# Altium schematic sheet 04_Mechanical.SchDoc: Mechanicals
size A; Revision: A; SheetNumber: 4; SheetTotal: 4; ECE315_Project_Name: ECE453 Base Project
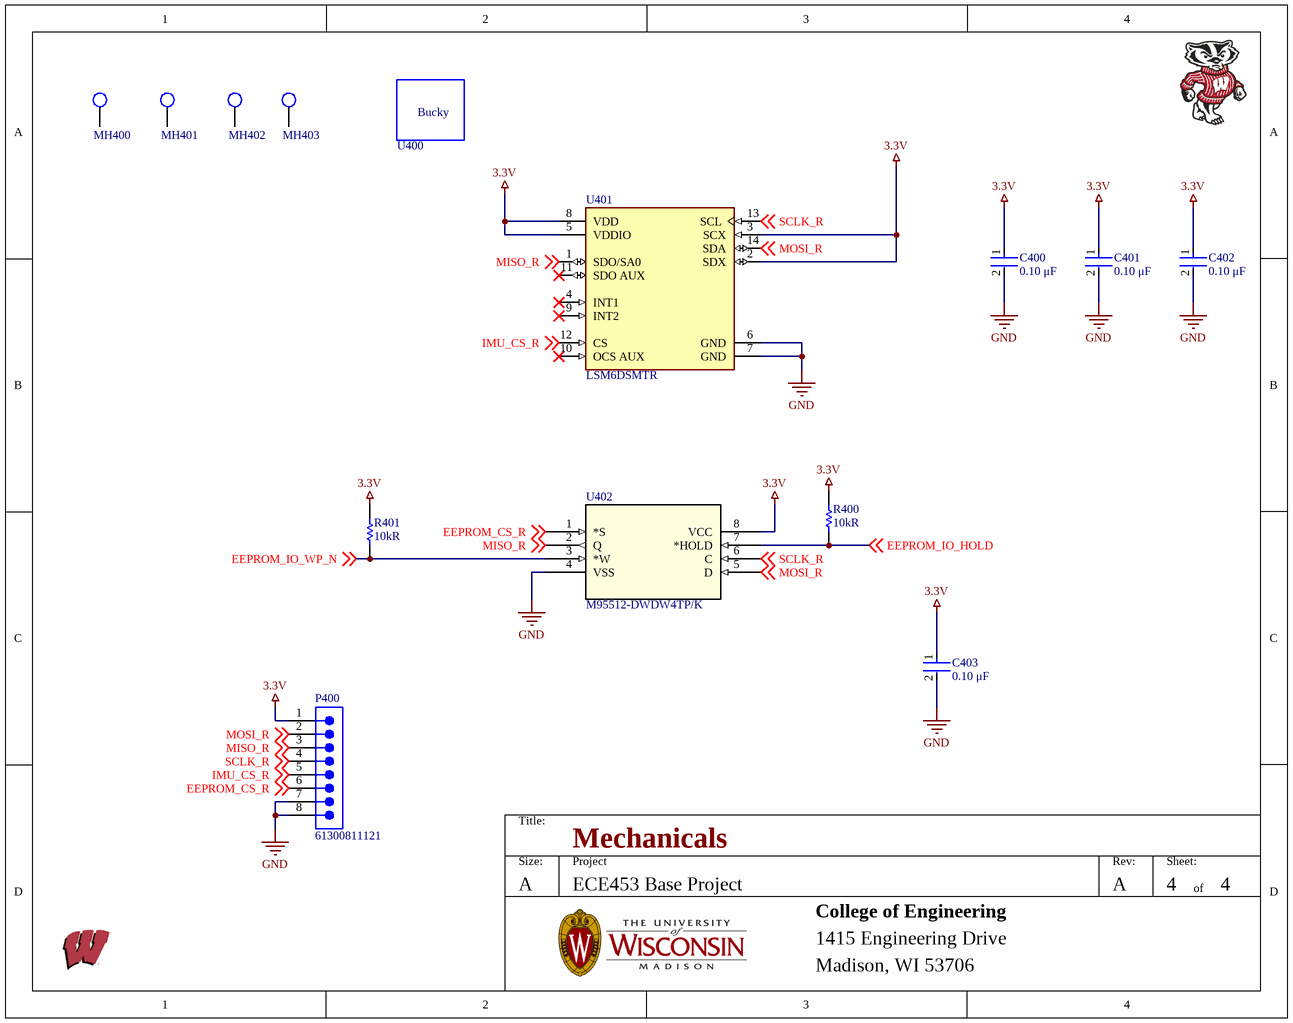
[diagram p0: 04_Mechanical.SchDoc]

## Parts
C400  0.10 μF  [FP-C0805C-DN-MFG]
C401  0.10 μF  [FP-C0805C-DN-MFG]
C402  0.10 μF  [FP-C0805C-DN-MFG]
C403  0.10 μF  [FP-C0805C-DN-MFG]
MH400  MHOLE_2_55MM  [MHOLE_2_55MM]  (value not drawn)
MH401  MHOLE_2_55MM  [MHOLE_2_55MM]  (value not drawn)
MH402  MHOLE_2_55MM  [MHOLE_2_55MM]  (value not drawn)
MH403  MHOLE_2_55MM  [MHOLE_2_55MM]  (value not drawn)
P400  61300811121  [61300811121]
R400  10kR  [RESC2013X70X40ML20T20]
R401  10kR  [RESC2013X70X40ML20T20]
U400  Bucky  [WalkingBucky]  (value not drawn)  (no BOM)
U401  LSM6DSMTR  [FP-LGA-14L-DM00249496-MFG]
U402  M95512-DWDW4TP/K  [TSSOP8_169MILS_DW_STM-M]

## Nets
3.3V: C400.1 C401.1 C402.1 C403.1 P400.1 R400.2 R401.2 U401.2(SDX) U401.3(SCX) U401.5(VDDIO) U401.8(VDD) U402.8(VCC)
GND: C400.2 C401.2 C402.2 C403.2 P400.7 P400.8 U401.6(GND) U401.7(GND) U402.4(VSS)
EEPROM_CS_R: P400.6 U402.1(*S) ; off-sheet EEPROM_CS_R
EEPROM_IO_HOLD: R400.1 U402.7(*HOLD) ; off-sheet EEPROM_IO_HOLD
EEPROM_IO_WP_N: R401.1 U402.3(*W) ; off-sheet EEPROM_IO_WP_N
IMU_CS_R: P400.5 U401.12(CS) ; off-sheet IMU_CS_R
MISO_R: P400.3 U401.1(SDO/SA0) U402.2(Q) ; off-sheet MISO_R
MOSI_R: P400.2 U401.14(SDA) U402.5(D) ; off-sheet MOSI_R
SCLK_R: P400.4 U401.13(SCL) U402.6(C) ; off-sheet SCLK_R

Not connected (* = marked no-connect by the designer): MH400 1; MH401 1; MH402 1; MH403 1; U401 4(INT1)* 9(INT2)* 10(OCS_AUX)* 11(SDO_AUX)*

## Notes on the sheet
- Title:
- Size:
- A
- Project
- Rev:
- Sheet:
- of
- College of Engineering
- 1415 Engineering Drive
- Madison, WI 53706

## Library data of the parts
C400-C403 = CMP-2007-00279-2: CAP CER 0.1UF 50V X7R 0805; Manufacturer Part Number: C0805C104K5RACTU; Manufacturer: KEMET; Tolerance: 0.1; Temperature Coefficient: 30ppm/°C; Material: Ceramic; Voltage: 500V; Device Class L2: Capacitors; Temperature Range Low: -55°C; Voltage Rating: 50 V; Digikey Description: CAP CER 0.1UF 50V X7R 0805; Value: 0.10 μF; Category: Cap; ComponentLink2Description: Datasheet; Octopart: https://octopart.com/c0805c104k5ractu-kemet-143926; RoHS: TRUE; ComponentLink2URL: https://content.kemet.com/datasheets/KEM_C1003_C0G_SMD.pdf; Temperature Characteristic: X7R; Temperature: -55°C to +125°C; Height: 0.88mm; Temperature Range High: +125°C; Device Class L1: Passive Components; Automotive: No; Lead Free: Yes; Ipc Land Pattern Name: CAPC200125X78; Device Class L3: Ceramic Capacitors; Mouser Description: Cap Ceramic 0.1uF 50V X7R 10% SMD 2.0 x 1.2 mm 125 C Paper T/R; Capacitance: 0.10 μF; Package: C0805C-DN; Supplier: Digikey; Supplier Part Number: 399-C0805C104K5RAC7800CT-ND; Stock: 1813524; Pricing: 1=0.14, 10=0.091, 50=0.0546, 100=0.043, 500=0.03172, 1000=0.02627 (USD); Mounting Technology: Surface Mount,PCB; Case/Package: 0805; Pins: 2; Case Code (Imperial): 0805; Case Code (Metric): 2012; Min Operating Temperature: -55°C; Max Operating Temperature: 125°C; Dielectric: X7R; Package Quantity: 4000; Packaging: Tape and Reel; Voltage Rating (DC): 50V; Termination: SMD/SMT; Series: SMD Comm X7R; Construction: Flat; Length: 2mm; Width: 1.2mm; Depth: 1.25mm; Lead Pitch: 0.75mm; Radiation Hardening: No; RoHS Compliant: Yes; Reach SVHC Compliant: No; ComponentLink1URL: https://datasheet.ciiva.com/32431/slceramic-chip-condensers-e-32431755.pdf?src-supplier=Distrelec; ComponentLink1Description: https://datasheet.ciiva.com/32431/slceramic-chip-condensers-e-32431755.pdf?src-supplier=Distrelec; ComponentLink3URL: https://datasheet.ciiva.com/28682/1851736-28682232.pdf?src-supplier=Element14; ComponentLink3Description: https://datasheet.ciiva.com/28682/1851736-28682232.pdf?src-supplier=Element14; ComponentLink4URL: https://datasheet.ciiva.com/18410/70095383-18410815.pdf?src-supplier=Allied+Electronics; ComponentLink4Description: https://datasheet.ciiva.com/18410/70095383-18410815.pdf?src-supplier=Allied+Electronics; ComponentLink5URL: https://datasheet.ciiva.com/14589/70095383-14589048.pdf?src-supplier=Allied+Electronics; ComponentLink5Description: https://datasheet.ciiva.com/14589/70095383-14589048.pdf?src-supplier=Allied+Electronics
MH400-MH403 = MHOLE_2_55MM: Mounting Holde; Manufacturer Part Number: UW MTHOLE
P400 = CMP-1502-01076-2: NexarPartId: 32855533; Manufacturer: Wurth Electronics; Current Rating: 3A; Connector Type: Male Pin; Voltage Rating: 250V; Number of Contacts: 8; Pitch: 2.54mm; Contact Resistance: 20mΩ; Gender: Male; REACH SVHC: Unknown; Number of Rows: 1; Mount: Through Hole; Termination: Solder; Number of Pins: 8; Number of Positions: 8; Height: 8.54mm; Contact Mating Length: 5.9944mm; Orientation: Vertical; Operating Supply Voltage: 250V; Min Operating Temperature: -40°C; Max Operating Temperature: 105°C; Packaging: Bulk; Color: Black; Lead Pitch: 2.54mm; RoHS: Compliant; Contact Material: Copper; Contact Plating: Gold; Supplier: Digikey; Supplier Part Number: 732-5321-ND; Manufacturer Part Number: 61300811121; Category: Headers and Wire Housings; Stock: 13018; Pricing: 1=0.4, 10=0.336, 25=0.28, 50=0.234, 100=0.212, 1000=0.193 (USD); Mounting Technology: Through Hole; Series: WR-PHD; Contact Type: Male Pin; RoHS Compliant: Yes; Reach SVHC Compliant: Unknown; ComponentLink1URL: https://datasheet.octopart.com/61300811121-W%C3%BCrth-Elektronik-datasheet-21154836.pdf?src-supplier=Element14; ComponentLink1Description: https://datasheet.octopart.com/61300811121-W%C3%BCrth-Elektronik-datasheet-21154836.pdf?src-supplier=Element14; ComponentLink2URL: https://katalog.we-online.de/em/datasheet/6130xx11121.pdf?src-supplier=Digikey; ComponentLink2Description: https://katalog.we-online.de/em/datasheet/6130xx11121.pdf?src-supplier=Digikey
R400 R401 = CMP-2001-04376-1: Manufacturer: Panasonic; Part Number: ERJ-6ENF1002V; Tolerance: 1%; Power: 125mW; Rated Temperature: 70°C; Temperature Coefficient: 100ppm/°C; Working Voltage: 150V; Package Height: 0.6mm; Package Length: 2mm; Package Width: 1.25mm; Reference Standard: AEC-Q200; Supplier: Digikey; Supplier Part Number: P10.0KCCT-ND; Manufacturer Part Number: ERJ-6ENF1002V; RoHS: Yes; Category: Chip SMD Resistors; Stock: 663782; Pricing: 1=0.11, 10=0.053, 50=0.0344, 100=0.0292, 500=0.02058, 1000=0.01792 (USD); Mounting Technology: Surface Mount; Pins: 2; Package Shape: Rectangular; Case/Package: 0805; Terminal Finish: Nickel; Min Operating Temperature: -55°C; Max Operating Temperature: 155°C; JESD-609 Code: e3; Resistor Type: FIXED RESISTOR; Construction: Rectangular; Package Style: SMTMeter; Packaging: Tape and Reel; Value: 10kR; Technology: METAL GLAZE/THICK FILM; Termination: Wraparound; Reach SVHC Compliant: Yes; RoHS Compliant: Yes; ComponentLink1URL: https://datasheet.ciiva.com:443/pdfs/VipMasterIC/IC/PANA/PANA-S-A0009889626/PANA-S-A0009889626-1.pdf?src-supplier=IHS+Markit; ComponentLink1Description: https://datasheet.ciiva.com:443/pdfs/VipMasterIC/IC/PANA/PANA-S-A0009889626/PANA-S-A0009889626-1.pdf?src-supplier=IHS+Markit; ComponentLink2URL: https://datasheet.ciiva.com/11808/0900766b80f80784-11808080.pdf?src-supplier=Rs; ComponentLink2Description: https://datasheet.ciiva.com/11808/0900766b80f80784-11808080.pdf?src-supplier=Rs; ComponentLink3URL: https://datasheet.ciiva.com/7830/426256-7830745.pdf?src-supplier=Element14; ComponentLink3Description: https://datasheet.ciiva.com/7830/426256-7830745.pdf?src-supplier=Element14; ComponentLink4URL: https://datasheet.ciiva.com/27055/1988971-27055733.pdf?src-supplier=Jameco; ComponentLink4Description: https://datasheet.ciiva.com/27055/1988971-27055733.pdf?src-supplier=Jameco; ComponentLink5URL: https://datasheet.ciiva.com/46372/1678782-46372715.pdf?src-supplier=Element14; ComponentLink5Description: https://datasheet.ciiva.com/46372/1678782-46372715.pdf?src-supplier=Element14; ComponentLink6URL: https://datasheet.ciiva.com/46372/1678782-46372714.pdf?src-supplier=Element14; ComponentLink6Description: https://datasheet.ciiva.com/46372/1678782-46372714.pdf?src-supplier=Element14; ComponentLink7URL: https://datasheet.ciiva.com/24070/aoa0000ce2-24070702.pdf?src-supplier=Mouser; ComponentLink7Description: https://datasheet.ciiva.com/24070/aoa0000ce2-24070702.pdf?src-supplier=Mouser; ComponentLink8URL: https://datasheet.ciiva.com/16725/70260748-16725031.pdf?src-supplier=Allied+Electronics; ComponentLink8Description: https://datasheet.ciiva.com/16725/70260748-16725031.pdf?src-supplier=Allied+Electronics; ComponentLink9URL: https://datasheet.ciiva.com/16759/70260748-16759350.pdf?src-supplier=Allied+Electronics; ComponentLink9Description: https://datasheet.ciiva.com/16759/70260748-16759350.pdf?src-supplier=Allied+Electronics; ComponentLink10URL: https://datasheet.ciiva.com/30140/aoa0000ce2-30140236.pdf?src-supplier=Onlinecomponents.com; ComponentLink10Description: https://datasheet.ciiva.com/30140/aoa0000ce2-30140236.pdf?src-supplier=Onlinecomponents.com
U400 = Bucky: Bucky Badger Image; Manufacturer Part Number: UW Bucky
U401 = CMP-12177-000008-1: IMU ACCEL/GYRO I2C/SPI 14LGA; Manufacturer: STMicroelectronics; Operating Supply Current: 0.29-0.65mA; Gyro Range: 125/250/500/1000/2000°/s; Sensor Output: I2C,SPI; Accel Range: 2/4/8/16g; Min Supply Voltage: 1.62V; Resolution: 16bits; Sensor Type: Temperature,Accelerometer,Gyroscope; Max Supply Voltage: 3.6V; Interface: SPI,Serial; Density: 512Kb; Memory Format: EEPROM; Frequency: 16MHz; Access Time-Max: 25ns; Organization: 64KX8; Programming Voltage: 5.5V; Write Protection: YES; Supply Current: 4mA; Manufacturer Part Number: LSM6DSMTR; Octopart: https://octopart.com/lsm6dsmtr-stmicroelectronics-66358194; Height: 0.86mm; Category: IC; Lead Free: Yes; Temperature: -40°C to +85°C; Temperature Range Low: -40°C; ComponentLink2Description: Datasheet; ComponentLink2URL: https://www.st.com/resource/en/datasheet/lsm6dsm.pdf; Digikey Description: IMU ACCEL/GYRO I2C/SPI 14LGA; Footprint Url: https://www.st.com/content/ccc/resource/technical/document/technical_note/73/17/9c/16/dd/96/4a/01/CD00134799.pdf/files/CD00134799.pdf/jcr:content/translations/en.CD00134799.pdf; Device Class L1: Sensors; Device Class L2: Motion Sensors; Temperature Range High: +85°C; Mouser Description: LSM6DSM Series 3.6 V I2C/SPI 3D Accelerometer and 3D Gyroscope - LGA-14; Device Class L3: Inertial Measurement Units (IMUs); Automotive: No; Package: LGA-14L-DM00249496; RoHS: TRUE; Supplier: Digikey; Supplier Part Number: 497-14459-1-ND; Stock: 18746; Pricing: 1=2.2, 10=1.974, 25=1.9432, 50=1.938, 100=1.7317, 250=1.6748, 500=1.6687, 1000=1.55386 (USD); Mounting Technology: Surface Mount; Case/Package: TSSOP; Pins: 8; Min Operating Temperature: -40°C; Max Operating Temperature: 145°C; Packaging: Tape and Reel; Clock Frequency: 16MHz; Series: -; Radiation Hardening: No; RoHS Compliant: Yes; ComponentLink1URL: https://datasheet.ciiva.com/29614/dm00046608-29614432.pdf?src-supplier=Digikey; ComponentLink1Description: https://datasheet.ciiva.com/29614/dm00046608-29614432.pdf?src-supplier=Digikey; ComponentLink3URL: https://datasheet.ciiva.com/48501/dm00046608-48501612.pdf?src-supplier=Avnet; ComponentLink3Description: https://datasheet.ciiva.com/48501/dm00046608-48501612.pdf?src-supplier=Avnet
U402 = M95512-DWDW4TP/K: EEPROM Serial-SPI 512K-bit 64K x 8 3.3V/5V Automotive 8-Pin TSSOP T/R; Mfr_Name: STMicroelectronics; Interface: SPI,Serial; Access Time: 25ns; Density: 512Kb; Frequency: 10MHz; Min Supply Voltage: 2.5V; Max Supply Voltage: 5.5V; Max Frequency: 16MHz; Nominal Supply Current: 4mA; Copyright: Copyright (C) 2022 Ultra Librarian. All rights reserved.; Manufacturer_Part_Number: M95512-DWDW4TP/K; RefDes: RefDes; Type: DEV; Supplier 1: Digi-Key; Supplier Part Number 1: 497-14459-1-ND; Manufacturer 1: STMicroelectronics; Manufacturer Part Number 1: M95512-DWDW4TP/K; RoHS: Yes; Category: EEPROM; Stock 1: 11469; Pricing 1: 1=2.30000, 10=2.07100, 25=2.03920, 50=2.03400, 100=1.81740, 250=1.76084 (USD); Mount: Surface Mount; Case/Package: TSSOP; Number of Pins: 8; Min Operating Temperature: -40°C; Max Operating Temperature: 145°C; Packaging: Tape and Reel; Memory Type: EEPROM; Radiation Hardening: No; RoHS Compliant: Yes; ComponentLink1URL: https://datasheet.ciiva.com/29614/dm00046608-29614432.pdf?src-supplier=Digi-Key; ComponentLink1Description: https://datasheet.ciiva.com/29614/dm00046608-29614432.pdf?src-supplier=Digi-Key; ComponentLink2URL: https://datasheet.ciiva.com/48501/dm00046608-48501612.pdf?src-supplier=Avnet; ComponentLink2Description: https://datasheet.ciiva.com/48501/dm00046608-48501612.pdf?src-supplier=Avnet